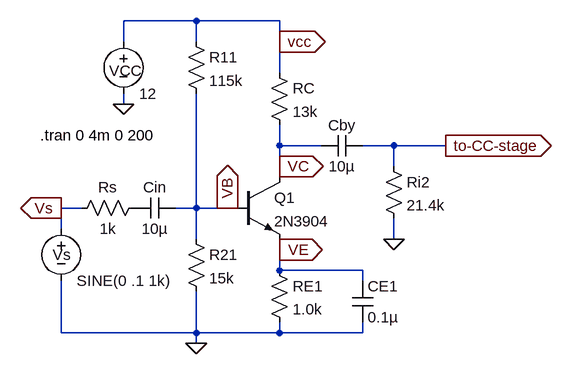
[diagram p0: schematic casc_ce01_emitter-bypass.asc]
casc_ce01_emitter-bypass.asc, the LTspice schematic file:
Version 4
SHEET 1 880 680
WIRE 256 -176 144 -176
WIRE 384 -176 256 -176
WIRE 144 -144 144 -176
WIRE 256 -144 256 -176
WIRE 384 -144 384 -176
WIRE 384 -96 384 -144
WIRE 144 -48 144 -64
WIRE 384 16 384 -16
WIRE 448 16 384 16
WIRE 560 16 512 16
WIRE 640 16 560 16
WIRE 384 48 384 16
WIRE 560 48 560 16
WIRE 384 64 384 48
WIRE 80 112 48 112
WIRE 256 112 256 -64
WIRE 256 112 224 112
WIRE 304 112 256 112
WIRE 320 112 304 112
WIRE 48 144 48 112
WIRE 256 160 256 112
WIRE 560 160 560 128
WIRE 384 176 384 160
WIRE 384 208 384 176
WIRE 512 208 384 208
WIRE 512 224 512 208
WIRE 48 304 48 224
WIRE 256 304 256 240
WIRE 256 304 48 304
WIRE 384 304 384 288
WIRE 384 304 256 304
WIRE 512 304 512 288
WIRE 512 304 384 304
WIRE 256 320 256 304
FLAG 144 -48 0
FLAG 256 320 0
FLAG 304 112 VB
IOPIN 304 112 Out
FLAG 384 176 VE
IOPIN 384 176 Out
FLAG 384 48 VC
IOPIN 384 48 Out
FLAG 384 -144 vcc
IOPIN 384 -144 Out
FLAG 48 112 Vs
IOPIN 48 112 Out
FLAG 560 160 0
FLAG 640 16 to-CC-stage
IOPIN 640 16 Out
SYMBOL voltage 48 128 R0
WINDOW 0 -13 56 Left 2
WINDOW 123 24 124 Left 2
WINDOW 39 0 0 Left 0
SYMATTR InstName Vs
SYMATTR Value SINE(0 .1 1k)
SYMBOL res 240 -160 R0
SYMATTR InstName R11
SYMATTR Value 115k
SYMBOL res 240 144 R0
SYMATTR InstName R21
SYMATTR Value 15k
SYMBOL npn 320 64 R0
SYMATTR InstName Q1
SYMATTR Value 2N3904
SYMBOL res 368 -112 R0
SYMATTR InstName RC
SYMATTR Value 13k
SYMBOL res 368 192 R0
SYMATTR InstName RE1
SYMATTR Value 1.0k
SYMBOL res 176 96 R90
WINDOW 0 0 56 VBottom 2
WINDOW 3 32 56 VTop 2
SYMATTR InstName Rs
SYMATTR Value 1k
SYMBOL cap 224 96 R90
WINDOW 0 0 32 VBottom 2
WINDOW 3 32 32 VTop 2
SYMATTR InstName Cin
SYMATTR Value 10µ
SYMBOL voltage 144 -160 R0
WINDOW 0 -22 61 Left 2
SYMATTR InstName VCC
SYMATTR Value 12
SYMBOL cap 512 0 R90
WINDOW 0 0 32 VBottom 2
WINDOW 3 32 32 VTop 2
SYMATTR InstName Cby
SYMATTR Value 10µ
SYMBOL res 544 32 R0
SYMATTR InstName Ri2
SYMATTR Value 21.4k
SYMBOL cap 496 224 R0
SYMATTR InstName CE1
SYMATTR Value 0.1µ
TEXT 16 0 Left 2 !.tran 0 4m 0 200

The netlist it stands for:
* casc_ce01_emitter-bypass.asc
Vs Vs 0 SINE(0 .1 1k)
R11 vcc VB 115k
R21 VB 0 15k
Q1 VC VB VE 0 2N3904
RC vcc VC 13k
RE1 VE 0 1.0k
Rs P001 Vs 1k
Cin VB P001 10µ
VCC vcc 0 12
Cby to-CC-stage VC 10µ
Ri2 to-CC-stage 0 21.4k
CE1 VE 0 0.1µ
.model NPN NPN
.model PNP PNP
.lib standard.bjt
.tran 0 4m 0 200
.backanno
.end